# EAGLE design Mini_1284 (EAGLE 7.7.0)
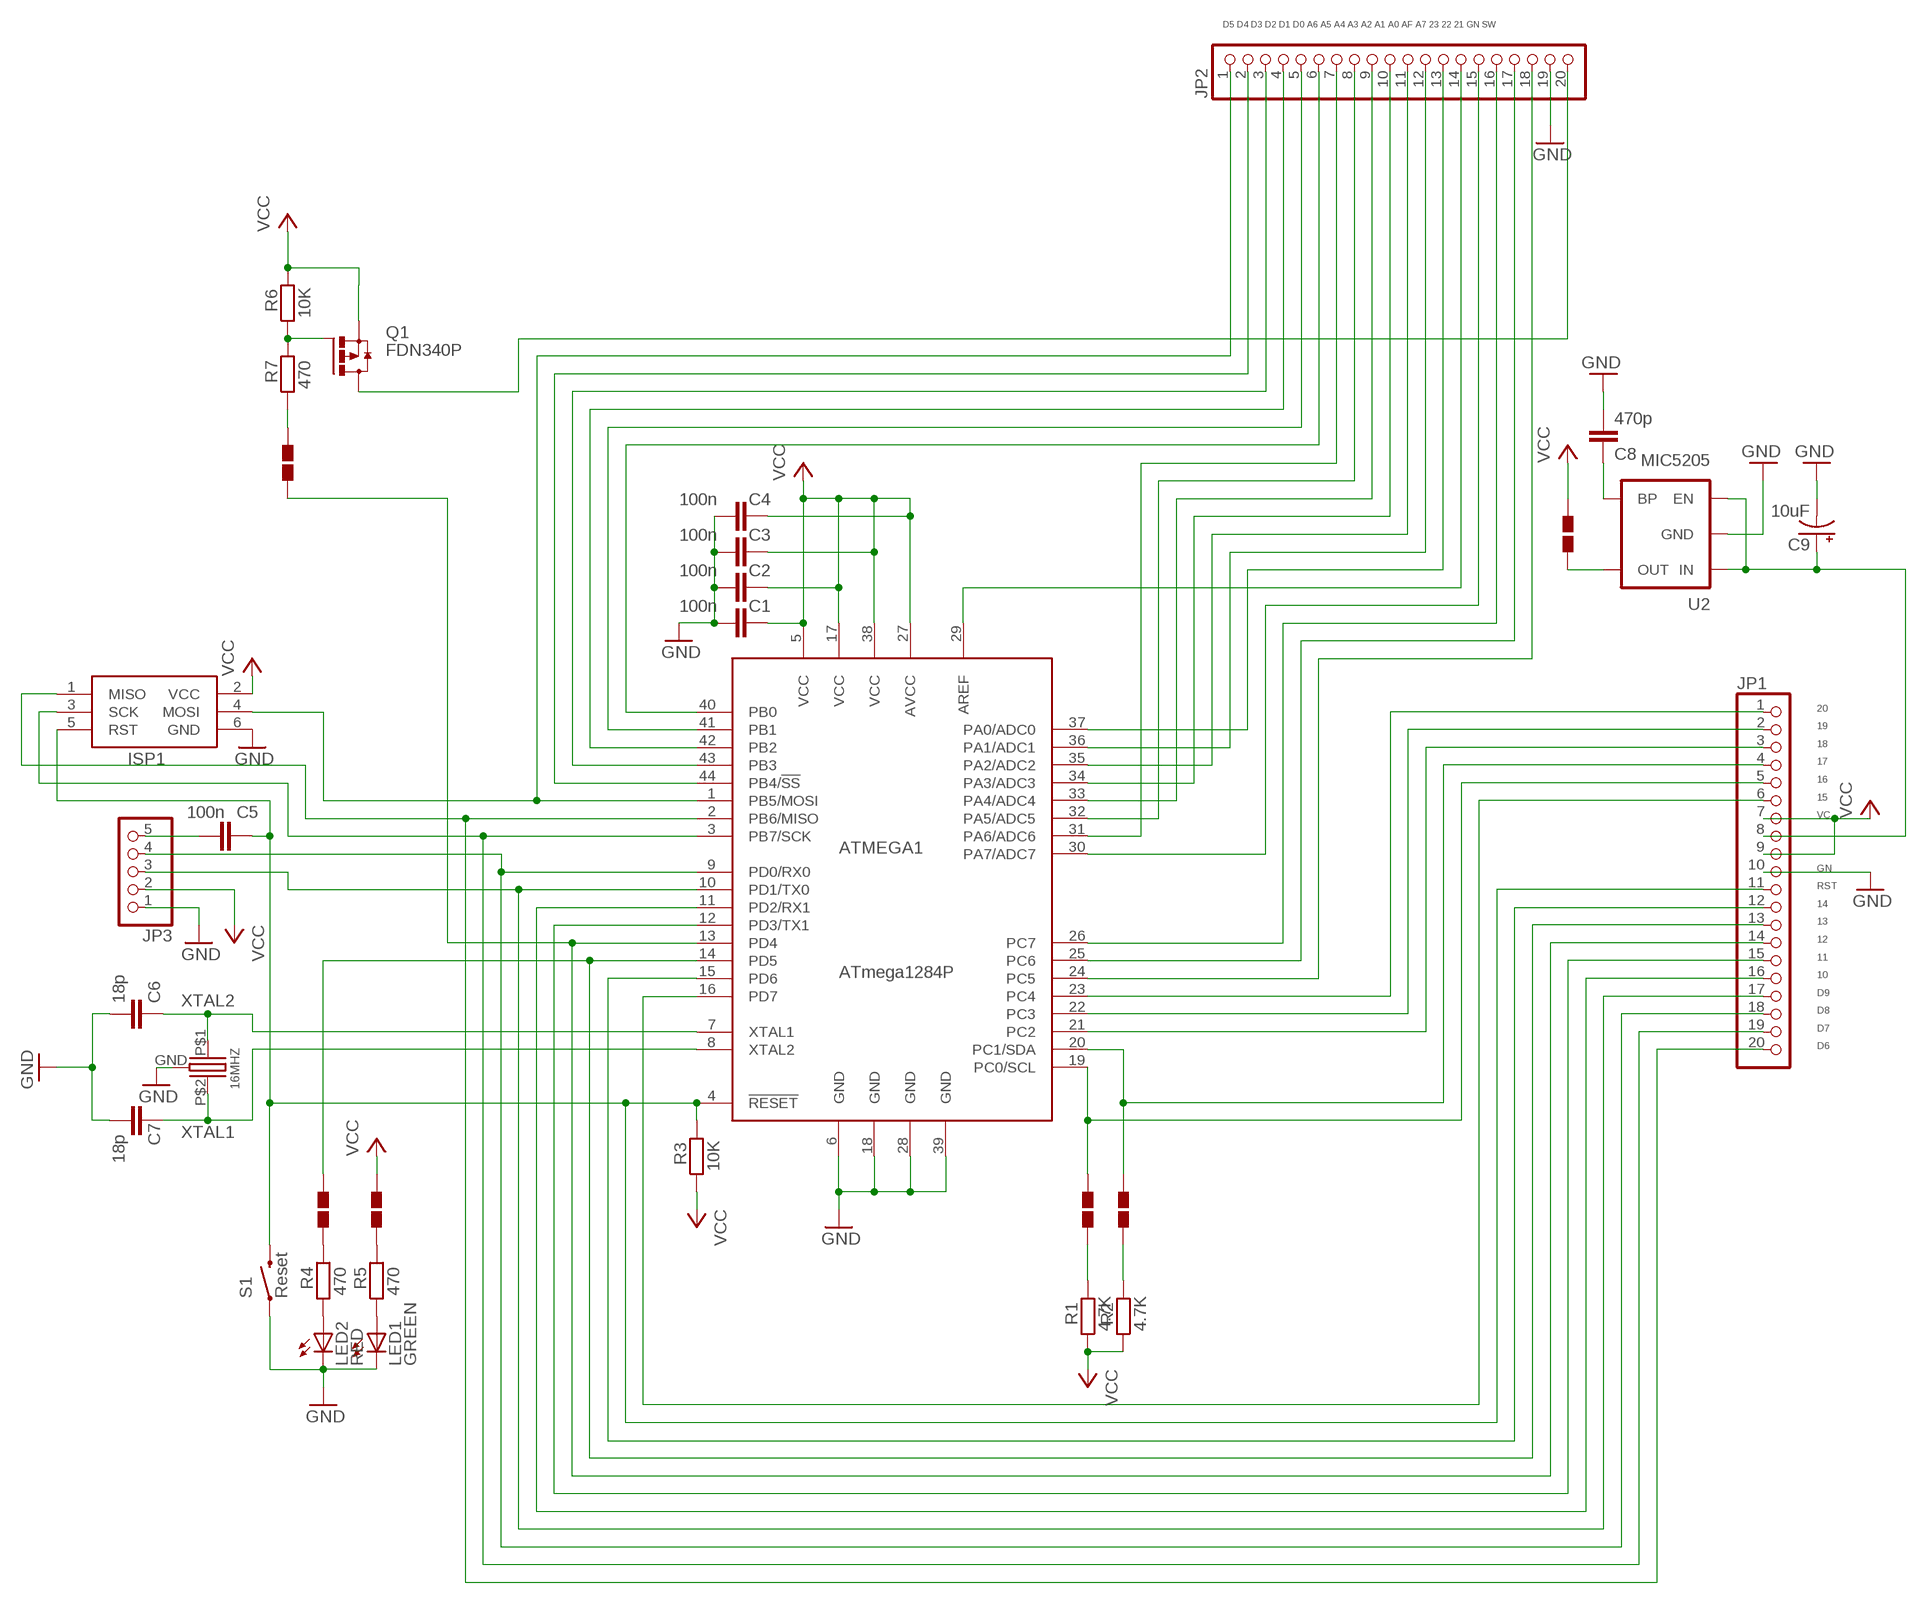
[diagram p0: schematic, sheet 1]

## Parts
16MHZ  CX2520  [CX2520]
ATMEGA1  ATmega1284P  ATMEGA164A/PA/324A/PA/644A/PA/1284/P  [44TQFP]
C1  100n  C0603-ROUND  [C0603-ROUND]
C2  100n  C0603-ROUND  [C0603-ROUND]
C3  100n  C0603-ROUND  [C0603-ROUND]
C4  100n  C0603-ROUND  [C0603-ROUND]
C5  100n  C0603-ROUND  [C0603-ROUND]
C6  18p  C0603-ROUND  [C0603-ROUND]
C7  18p  C0603-ROUND  [C0603-ROUND]
C8  470p  C0603-ROUND  [C0603-ROUND]
C9  10uF  CAP_POL1206  [EIA3216]
ISP1  AVRISP-6  [AVRISP]
JP1  PINHD-1X20  [1X20]
JP2  PINHD-1X20  [1X20]
JP3  PINHD-1X5  [1X05]
LED1  GREEN  LEDCHIP-LED0805  [CHIP-LED0805]
LED2  RED  LEDCHIP-LED0805  [CHIP-LED0805]
Q1  FDN340P  FDN360P  [SUPER-SOT3]
R1  4.7K  R0603-ROUND  [R0603-ROUND]
R2  4.7K  R0603-ROUND  [R0603-ROUND]
R3  10K  R0603-ROUND  [R0603-ROUND]
R4  470  R0603-ROUND  [R0603-ROUND]
R5  470  R0603-ROUND  [R0603-ROUND]
R6  10K  R0603-ROUND  [R0603-ROUND]
R7  470  R0603-ROUND  [R0603-ROUND]
S1  Reset  SWITCH-MOMENTARY-2SMD-ALT01  [TACTILE-SWITCH-SMD-ALT01]
U2  MIC5205  V_REG_LDOSMD  [SOT23-5]
U$4  SOL-PAD-OPEN  [SOL-PAD-OPEN]
U$5  SOL-PAD-OPEN  [SOL-PAD-OPEN]
U$8  SOL-PAD-OPEN  [SOL-PAD-OPEN]
U$9  SOL-PAD-OPEN  [SOL-PAD-OPEN]
U$12  SOL-PAD-OPEN  [SOL-PAD-OPEN]
U$13  SOL-PAD-OPEN  [SOL-PAD-OPEN]

## Nets
GND [gnd]: 16MHZ.GND ATMEGA1.6(GND) ATMEGA1.18(GND) ATMEGA1.28(GND) ATMEGA1.39(GND) C1.2 C2.2 C3.2 C4.2 C6.2 C7.2 C8.2 C9.C(-) ISP1.6(GND) JP1.10 JP2.19 JP3.1 LED1.C LED2.C S1.1 S1.2 U2.2(GND)
N$1: ATMEGA1.4(!RESET) C5.1 ISP1.5(RST) JP1.11 R3.2 S1.3 S1.4
N$2: C5.2 JP3.5
N$3: LED2.A R4.1
N$4: ATMEGA1.10(PD1/TX0) JP1.17 JP3.3
N$5: ATMEGA1.9(PD0/RX0) JP1.18 JP3.4
N$6: R1.2 U$4.P$1
N$7: ATMEGA1.20(PC1/SDA) JP1.4 U$12.P$1
N$8: LED1.A R5.1
N$9: R5.2 U$8.P$1
N$10: ATMEGA1.3(PB7/SCK) ISP1.3(SCK) JP1.19
N$11: ATMEGA1.2(PB6/MISO) ISP1.1(MISO) JP1.20
N$12: ATMEGA1.1(PB5/MOSI) ISP1.4(MOSI) JP2.1
N$13: R4.2 U$9.P$1
N$14: ATMEGA1.14(PD5) JP1.13 U$9.P$2
N$15: R2.2 U$12.P$2
N$16: ATMEGA1.23(PC4) JP1.1
N$17: ATMEGA1.19(PC0/SCL) JP1.5 U$4.P$2
N$18: ATMEGA1.16(PD7) JP1.6
N$19: ATMEGA1.15(PD6) JP1.12
N$20: ATMEGA1.40(PB0) JP2.6
N$21: ATMEGA1.21(PC2) JP1.3
N$22: ATMEGA1.22(PC3) JP1.2
N$23: ATMEGA1.13(PD4) JP1.14 U$5.P$1
N$24: ATMEGA1.12(PD3/TX1) JP1.15
N$25: ATMEGA1.11(PD2/RX1) JP1.16
N$26: ATMEGA1.41(PB1) JP2.5
N$27: ATMEGA1.42(PB2) JP2.4
N$28: ATMEGA1.43(PB3) JP2.3
N$29: ATMEGA1.44(PB4/!SS) JP2.2
N$30: ATMEGA1.36(PA1/ADC1) JP2.12
N$31: ATMEGA1.31(PA6/ADC6) JP2.7
N$32: ATMEGA1.32(PA5/ADC5) JP2.8
N$33: ATMEGA1.33(PA4/ADC4) JP2.9
N$34: ATMEGA1.34(PA3/ADC3) JP2.10
N$35: ATMEGA1.35(PA2/ADC2) JP2.11
N$36: ATMEGA1.37(PA0/ADC0) JP2.13
N$37: ATMEGA1.29(AREF) JP2.14
N$38: ATMEGA1.30(PA7/ADC7) JP2.15
N$39: ATMEGA1.26(PC7) JP2.16
N$40: ATMEGA1.25(PC6) JP2.17
N$41: ATMEGA1.24(PC5) JP2.18
N$42 [vcc]: U2.5(OUT) U$13.P$2
N$43: C8.1 U2.4(BP)
N$44: Q1.1(G) R6.1 R7.2
N$45 [switch]: JP2.20 Q1.3(D)
N$46: R7.1 U$5.P$2
RAW [raw]: C9.A(+) JP1.8 U2.1(IN) U2.3(EN)
VCC [vcc]: ATMEGA1.5(VCC) ATMEGA1.17(VCC) ATMEGA1.27(AVCC) ATMEGA1.38(VCC) C1.1 C2.1 C3.1 C4.1 ISP1.2(VCC) JP1.7 JP1.9 JP3.2 Q1.2(S) R1.1 R2.1 R3.1 R6.2 U$8.P$2 U$13.P$1
XTAL1: 16MHZ.P$2(XTAL2) ATMEGA1.8(XTAL2) C7.1
XTAL2: 16MHZ.P$1(XTAL1) ATMEGA1.7(XTAL1) C6.1

## Notes on the sheet
- D5 D4 D3 D2 D1 D0 A6 A5 A4 A3 A2 A1 A0 AF A7 23 22 21 GN SW
- 20
  19
  18
  17
  16
  15
  VC
  
  
  GN
  RST
  14
  13
  12
  11
  10
  D9
  D8
  D7
  D6

## Library data of the parts
16MHZ = CX2520:CX2520: CX2520 Series Crystal
ATMEGA1 = BaseApp:ATMEGA164A/PA/324A/PA/644A/PA/1284/P: Digikey No :- __ATMEGA1284-AU-ND__ 44TQFP __ATMEGA1284-MU-ND__ 44VQFN
C1-C8 = Max-RCL:C
C9 = SparkFun:CAP_POL: Capacitor Polarized These are standard SMD and PTH capacitors. Normally 10uF, 47uF, and 100uF in electrolytic and tantalum varieties. Always verify the external diameter of the through hole cap, it varies with capacity, voltage, and manufacturer. The EIA devices should be standard.
ISP1 = adafruit:AVRISP: AVR ISP HEADER Standard 6 pin header for AVR programming
JP1 JP2 = adafruit:PINHD-1X20: PIN HEADER
JP3 = pinhead:PINHD-1X5: PIN HEADER
LED1 LED2 = adafruit:LED: LED OSRAM: - CHIPLED LG R971, LG N971, LY N971, LG Q971, LY Q971, LO R971, LY R971 LH N974, LH R974 LS Q976, LO Q976, LY Q976 LO Q996 - Hyper CHIPLED LW Q18S LB Q993, LB Q99A, LB R99A - SideLED LS A670, LO A670, LY A670, LG A670, LP A670 LB A673, LV A673, LT A673, LW A673 LH A674 LY A675 LS A676, LA A676, LO A676, LY A676, LW A676 LS A679, LY A679, LG A679 - Hyper Micro SIDELED® LS Y876, LA Y876, LO Y876, LY Y876 LT Y87S - SmartLED LW L88C, LW L88S LB L89C, LB L89S, LG L890 LS L89K, LO L89K, LY L89K LS L896, LA L896, LO L896, LY L896 - TOPLED LS T670, LO T670, LY T670, LG T670, LP T670 LSG T670, LSP T670, LSY T670, LOP T670, LYG T670 LG T671, LOG T671, LSG T671 LB T673, LV T673, LT T673, LW T673 LH T674 LS T676, LA T676, LO T676, LY T676, LB T676, LH T676, LSB T676, LW T676 LB T67C, LV T67C, LT T67C, LS T67K, LO T67K, LY T67K, LW E67C LS E67B, LA E67B, LO E67B, LY E67B, LB E67C, LV E67C, LT E67C LW T67C LS T679, LY T679, LG T679 LS T770, LO T770, LY T770, LG T770, LP T770 LB T773, LV T773, LT T773, LW T773 LH T774 LS E675, LA E675, LY E675, LS T675 LS T776, LA T776, LO T776, LY T776, LB T776 LHGB T686 LT T68C, LB T68C - Hyper Mini TOPLED® LB M676 - Mini TOPLED Santana® LG M470 LS M47K, LO M47K, LY M47K Source: http://www.osram.convergy.de/
Q1 = transistor-power:FDN360P: Single P-Channel, PowerTrench (R) MOSFET Source: http://www.fairchildsemi.com/ds/FD/FDN360P.pdf
R1-R7 = Max-RCL:R
S1 = Testing:SWITCH-MOMENTARY-2: Various NO switches- pushbuttons, reed, etc
U2 = SparkFun:V_REG_LDO: Voltage Regulator LDO Standard 150mA LDO voltage regulator in SOT-23 layout. Micrel part MIC5205. BP (by-pass) pin is used to lower output noise with 470pF cap.
U$4 U$5 U$8 U$9 U$12 U$13 = PAD:SOL-PAD-OPEN

## Net classes
0 default: width 0.152 mm
1 vcc: width 0.254 mm
2 gnd: width 0.254 mm
3 raw: width 0.254 mm
4 switch: width 0.254 mm

## Board
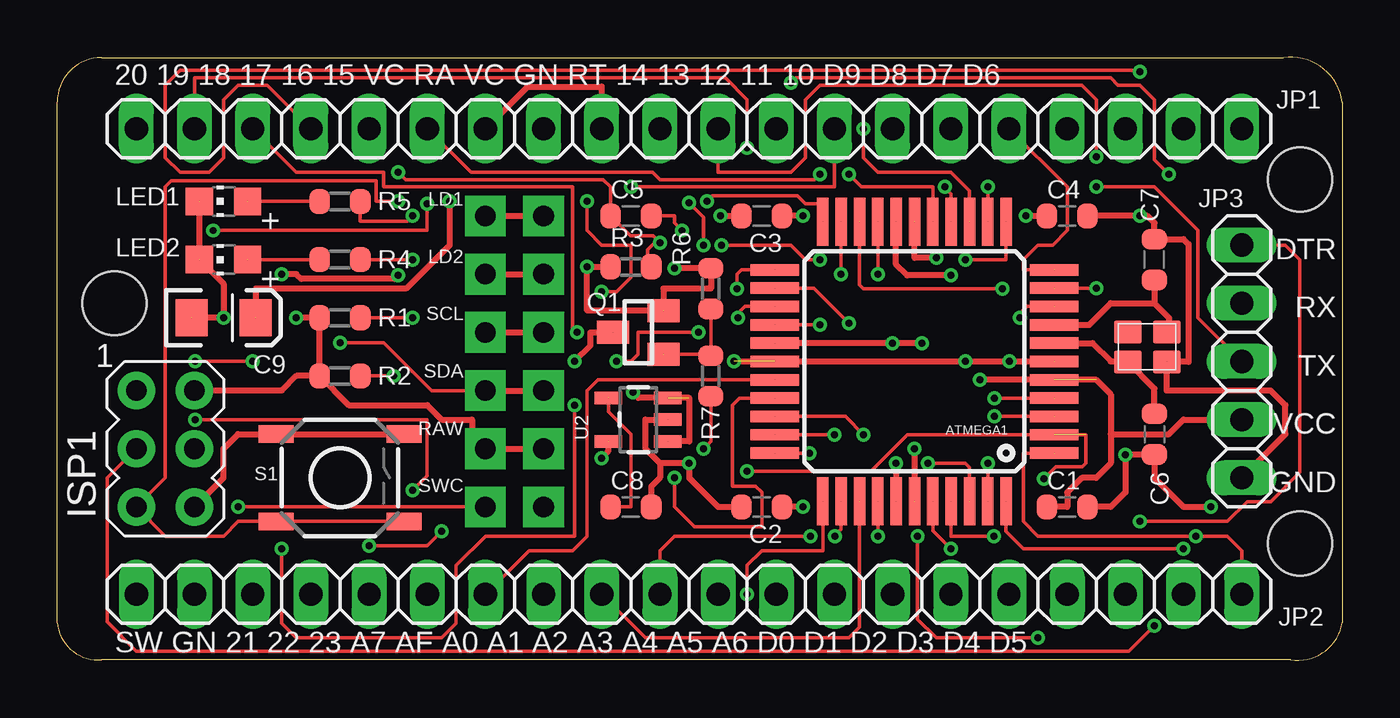
[diagram p1: board, top side]
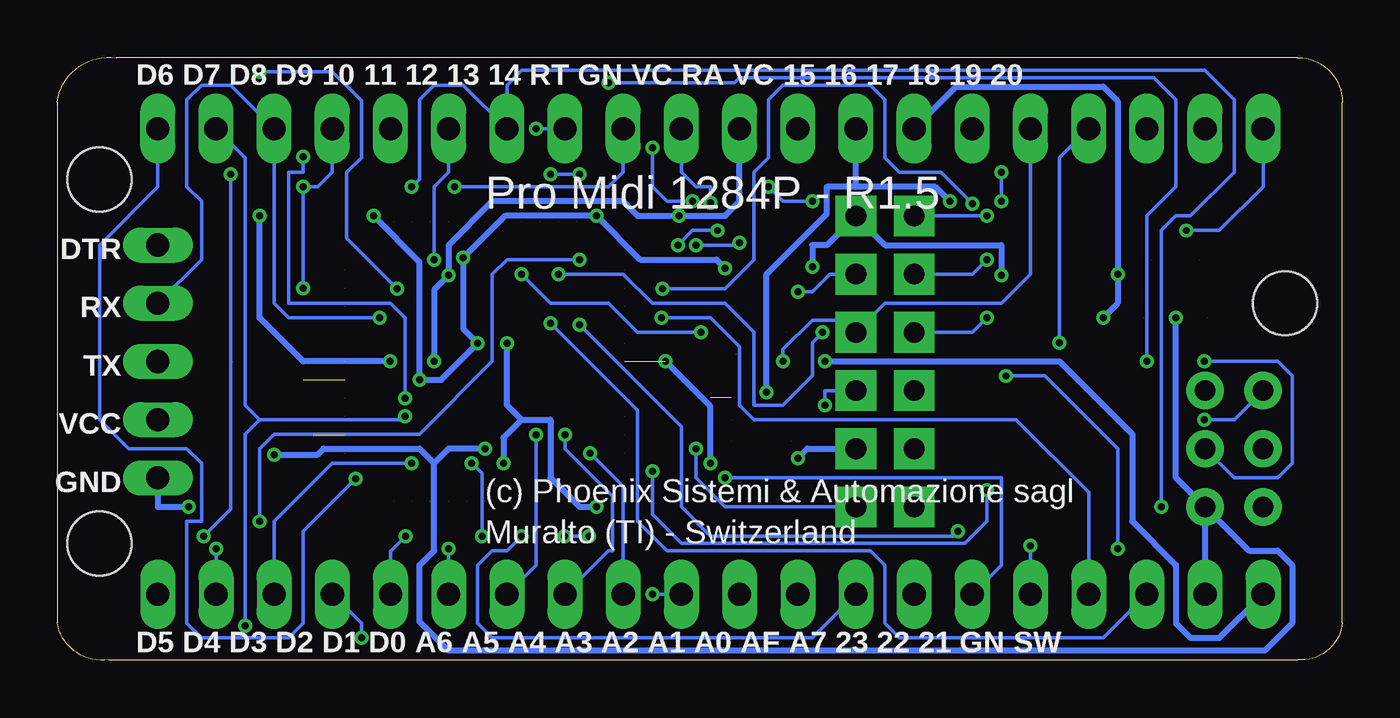
[diagram p2: board, bottom side, seen from below]

Size 56.1 x 26.32 mm. Coordinates in mm from the lower left corner, seen from the top.
Outline: 53.85,0.03 1.93,0.03 arc-90 0,1.64 0,24.36 arc-90 1.93,26.3 53.53,26.3 arc-90 56.1,24.36 56.1,1.64 arc-90 53.85,0.03
Copper layers (1*16): Top 0.035mm / dielectric 1.5mm / Bottom 0.035mm
Design rules "ITEADstudio_DRC": minimum track width 6mil, minimum drill 12mil, track to track 6mil, track to pad 6mil, pad to pad 6mil, via to via 6mil, smd to smd 0mil, copper to edge 10mil, drill to drill 10mil, minimum pad ring 10mil, minimum via ring 6mil, stop-mask expansion 2mil, vias tented up to drill 100mil, thermal gap 10mil
Holes 2.8 mm at 54.25,5.1 54.25,20.98 2.5,15.58
tRestrict: area 18.7,6.1 to 21.2,20

### Footprints (pad centres in the part's own frame; a part is rotated, then mirrored left to right if it is on the bottom)
CX2520 = smd 1.2 x 1: GND 0.85,-0.65; NC -0.85,0.65; P$1 -0.85,-0.65; P$2 0.85,0.65
44TQFP = smd 2.1 x 0.5: 1 -6.1,4; 2 -6.1,3.2; 3 -6.1,2.4; 4 -6.1,1.6; 5 -6.1,0.8; 6 -6.1,0; 7 -6.1,-0.8; 8 -6.1,-1.6; 9 -6.1,-2.4; 10 -6.1,-3.2; 11 -6.1,-4; 23 6.1,-4; 24 6.1,-3.2; 25 6.1,-2.4; 26 6.1,-1.6; 27 6.1,-0.8; 28 6.1,0; 29 6.1,0.8; 30 6.1,1.6; 31 6.1,2.4; 32 6.1,3.2; 33 6.1,4 | smd 0.5 x 2.1: 12 -4,-6.1; 13 -3.2,-6.1; 14 -2.4,-6.1; 15 -1.6,-6.1; 16 -0.8,-6.1; 17 0,-6.1; 18 0.8,-6.1; 19 1.6,-6.1; 20 2.4,-6.1; 21 3.2,-6.1; 22 4,-6.1; 34 4,6.1; 35 3.2,6.1; 36 2.4,6.1; 37 1.6,6.1; 38 0.8,6.1; 39 0,6.1; 40 -0.8,6.1; 41 -1.6,6.1; 42 -2.4,6.1; 43 -3.2,6.1; 44 -4,6.1
C0603-ROUND = smd 0.898 x 1.1: 1 -0.889,0; 2 0.889,0
EIA3216 = smd 1.4 x 1.6: A 1.4,0; C -1.4,0
AVRISP = drill 0.9 pad 1.626: 1 -1.27,2.54; 2 1.27,2.54; 3 -1.27,0; 4 1.27,0; 5 -1.27,-2.54; 6 1.27,-2.54
1X20 = drill 1.016 long: 1 -24.13,0; 2 -21.59,0; 3 -19.05,0; 4 -16.51,0; 5 -13.97,0; 6 -11.43,0; 7 -8.89,0; 8 -6.35,0; 9 -3.81,0; 10 -1.27,0; 11 1.27,0; 12 3.81,0; 13 6.35,0; 14 8.89,0; 15 11.43,0; 16 13.97,0; 17 16.51,0; 18 19.05,0; 19 21.59,0; 20 24.13,0
1X05 = drill 1.016 long: 1 -5.08,0; 2 -2.54,0; 3 0,0; 4 2.54,0; 5 5.08,0
CHIP-LED0805 = smd 1.2 x 1.2: A 0,-1.05; C 0,1.05
SUPER-SOT3 = smd 1 x 1.4: 1 -0.95,-1.1; 2 0.95,-1.1; 3 0,1.1
R0603-ROUND = smd 0.898 x 1.1: 1 -0.889,0; 2 0.889,0
TACTILE-SWITCH-SMD-ALT01 = smd 1.524 x 0.762: 1 -2.794,1.905; 2 2.794,1.905; 3 -2.794,-1.905; 4 2.794,-1.905
SOT23-5 = smd 0.55 x 1.2: 1 -0.95,-1.3; 2 0,-1.3; 3 0.95,-1.3; 4 0.95,1.3; 5 -0.95,1.3
SOL-PAD-OPEN = drill 0.9 pad 1.778 square: P$1 0,0; P$2 2.54,0

### Placement (x,y rotation side)
16MHZ  47.59,13.68 0 top
ATMEGA1  37.43,13.04 180 top
C1  44.09,6.69 0 top
C2  30.76,6.69 180 top
C3  30.76,19.39 180 top
C4  44.09,19.39 0 top
C5  25.04,19.39 0 top
C6  47.9,9.87 270 top
C7  47.9,17.49 90 top
C8  25.04,6.69 0 top
C9  7.26,14.95 0 top
ISP1  4.72,9.23 0 top
JP1  27.58,23.2 0 top
JP2  27.58,2.88 180 top
JP3  51.71,13.04 90 top
LED1  7.26,20.03 90 top
LED2  7.26,17.49 90 top
Q1  25.36,14.31 90 top
R1  12.34,14.95 0 top
R2  12.34,12.41 0 top
R3  25.04,17.17 0 top
R4  12.34,17.49 0 top
R5  12.34,20.03 0 top
R6  28.54,16.22 90 top
R7  28.54,12.41 90 top
S1  12.34,7.96 0 top
U2  25.36,10.5 90 top
U$4  18.69,14.31 0 top
U$5  18.69,6.69 0 top
U$8  18.69,19.39 0 top
U$9  18.69,16.85 0 top
U$12  18.69,11.77 0 top
U$13  18.69,9.23 0 top

### Tracks (layer width: path | path; a pad name or v marks a point on that pad's centre or on a via)
GND  (via drill 0.3 pad 0.61)  (9 unrouted)
  Top 0.254: 26.31,8.6 26.31,7.96 25.93,7.58 C8.2 | 26.31,8.6 25.68,9.23 25.68,10.5 U2.2 | C2.2 28.85,6.69 27.58,7.96 v27.58,8.6 26.31,8.6 | C1.2 46,6.69 46.63,7.33 v46.63,8.98 C6.2 47.9,7.96 49.17,6.69 v50.36,6.69 | LED1.C LED2.C 7.26,16.44 v7.26,14.95 C9.C | C4.2 v47.27,19.39 47.6,19.39 47.9,19.09 C7.2 49.17,18.37 49.38,18.16 49.38,13.03 16MHZ.GND 48.43,11.77 52.98,11.77 53.62,11.14 53.62,9.87 JP3.1 | ISP1.6 7.26,7.96 7.26,9.23 7.9,9.87 S1.1 S1.2 | v29.54,13.04 v39.65,13.04 v41.58,13.04 ATMEGA1.6 | v39.01,16.8 37.11,16.8 36.62,17.28 ATMEGA1.18 | v37.43,9.23 ATMEGA1.39 | v28.96,19.39 C3.2
  Bottom 0.254: ISP1.6 4.09,4.79 2.82,4.79 2.18,4.15 2.18,1.61 3.38,0.42 39.01,0.42 40.28,1.69 40.28,4.15 39.65,4.79 39.65,8.6 | v39.65,13.04 39.65,16.16 v39.01,16.8 39.01,18.12 37.11,20.03 31.39,20.03 30.76,19.39 v28.96,19.39 26.95,19.39 26.31,20.03 JP1.10 | v41.58,13.04 45.36,13.04 47.27,14.95 v47.27,19.39 | JP3.1 51.71,6.69 v50.36,6.69 | ISP1.6 7.26,7.96 v7.26,14.95 | v46.63,8.98 44.73,8.98 44.47,9.23 40.28,9.23 39.65,8.6 | ISP1.6 JP2.19 | v27.58,8.6 27.58,11.08 v29.54,13.04 | v37.43,9.23 39.01,9.23 39.65,8.6
N$1  (via drill 0.3 pad 0.61)  (1 unrouted)
  Top 0.152: R3.2 25.78,17.17 25.78,17.92 26.08,18.22 v26.31,18.22 26.02,18.52 25.03,18.52 C5.1 24.15,20.66 23.84,20.98 15.2,20.98 v14.88,21.3 | v14.88,20.03 13.93,20.03 13.93,20.92 4.99,20.92 4.72,20.66 4.72,7.96 ISP1.5 4.72,5.42 7.26,5.42 7.9,6.06 S1.3 S1.4 | v28.22,18.12 28.22,19.34 v27.58,19.97 | v40.92,11.44 ATMEGA1.4 | JP1.11 28.85,21.3 32.03,21.3 32.66,21.93 32.66,24.47 33.3,25.11 44.73,25.11 45.36,24.47 v45.36,21.98
  Bottom 0.152: v14.88,20.03 v14.88,21.3 | JP1.11 28.85,21.3 28.22,20.66 27.58,20.66 v27.58,19.97 | v26.31,18.22 26.41,18.12 v28.22,18.12 | v45.36,21.98 45.36,21.3 46,21.3 46,15.58 41.55,15.58 40.92,14.95 v40.92,11.44
N$2  (via drill 0.3 pad 0.61)
  Top 0.152: v27.29,18.76 26.95,19.09 26.95,19.39 C5.2 | v33.3,17.49 32.66,17.49 32.03,18.12 v29,18.12 | v47.27,6.06 51.08,6.06 51.95,6.93 52.98,6.93 54.25,8.2 54.25,17.49 53.62,18.12 JP3.5
  Bottom 0.152: v29,18.12 28.37,18.76 v27.29,18.76 | v47.27,6.06 47.27,9.23 46.63,9.87 40.28,9.87 37.11,13.04 37.11,16.85 36.47,17.49 v33.3,17.49
N$3  (1 unrouted)
  Top 0.152: R4.1 LED2.A
N$4  (via drill 0.3 pad 0.61)  (1 unrouted)
  Top 0.152: v45.36,20.66 47.9,20.66 49.81,18.76 49.81,14.95 JP3.3 | v45.36,16.24 ATMEGA1.10
  Bottom 0.152: JP1.17 44.09,21.3 44.73,20.66 v45.36,20.66 v45.36,16.24
N$5  (via drill 0.3 pad 0.61)  (1 unrouted)
  Top 0.152: v42.02,14.95 42.02,15.14 42.32,15.44 ATMEGA1.9
  Bottom 0.152: JP3.4 49.81,17.49 49.81,20.03 50.44,20.66 50.44,24.47 49.81,25.11 48.54,25.11 JP1.18 46.63,15.58 46,14.95 v42.02,14.95
N$6  (via drill 0.3 pad 0.61)
  Top 0.152: v15.52,14.95 R1.2
  Bottom 0.152: v15.52,14.95 16.15,14.31 U$4.P$1
N$7  (via drill 0.3 pad 0.61)  (1 unrouted)
  Top 0.152: v12.34,13.86 14.25,13.86 16.34,11.77 U$12.P$1 | v41.26,16.22 35.2,16.22 35.02,16.39 ATMEGA1.20 | JP1.4 9.17,25.11 7.9,25.11 7.26,24.47 7.26,21.93 6.63,21.3 5.36,21.3 4.72,21.93 4.72,25.11 5.36,25.74 47.22,25.74 v47.27,25.69
  Bottom 0.152: JP1.4 12.34,21.93 v12.34,13.86 | v47.27,25.69 44.09,25.69 42.82,24.42 42.82,21.93 43.46,21.3 43.46,18.42 v41.26,16.22
N$8  (1 unrouted)
  Top 0.152: LED1.A R5.1
N$9  (via drill 0.3 pad 0.61)
  Top 0.152: v15.52,19.39 15.28,19.15 13.23,19.15 R5.2
  Bottom 0.152: v15.52,19.39 U$8.P$1
N$10  (via drill 0.3 pad 0.61)  (1 unrouted)
  Top 0.152: v40.92,10.64 ATMEGA1.3 | v47.9,1.51 46.8,0.4 3.45,0.4 2.18,1.67 2.18,7.96 ISP1.3
  Bottom 0.152: 47.27,10.5 47.9,11.14 47.9,21.93 JP1.19 | 47.27,10.5 41.06,10.5 v40.92,10.64 | 47.27,10.5 47.9,9.87 v47.9,1.51
N$11  (via drill 0.3 pad 0.61)  (1 unrouted)
  Top 0.152: v30.12,8.25 35.52,8.25 37.11,9.84 44.91,9.84 44.91,8.6 44.75,8.44 43.6,8.44 v43.08,7.91 | v6.02,10.5 16.15,10.5 16.15,8.06 v15.52,7.43 | v43.08,7.91
  Bottom 0.152: v15.52,7.43 15.52,6.06 16.48,5.1 28.85,5.1 30.12,6.37 v30.12,8.25 | v6.02,10.5 4.72,10.5 ISP1.1 | v43.08,7.91 45.36,5.63 45.36,1.61 46,0.98 49.81,0.98 50.44,1.61 50.44,6.06 49.81,6.06 49.81,8.6 50.44,9.23 52.98,9.23 54.25,10.5 54.25,18.12 51.71,20.66 JP1.20
N$12  (via drill 0.3 pad 0.61)  (1 unrouted)
  Top 0.152: JP2.1 51.71,4.79 51.08,5.42 v49.71,5.42 42.82,5.42 42.19,6.06 42.19,9.04 ATMEGA1.1 | v32.03,25.21 32.24,25.42 46,25.42 46.32,25.11 47.27,25.11 47.9,24.47 47.9,21.84 v48.54,21.21 | v6.02,13.04 v8.53,13.04
  Bottom 0.152: v48.54,21.21 48.54,6.59 v49.71,5.42 | v8.53,13.04 8.53,19.39 7.26,20.66 7.26,24.47 8.22,25.42 26.31,25.42 26.53,25.21 v32.03,25.21 | v6.02,13.04 2.82,13.04 2.18,12.41 2.18,8.6 2.82,7.96 4.72,7.96 ISP1.4
N$13  (via drill 0.3 pad 0.61)
  Top 0.152: v15.52,17.49 R4.2
  Bottom 0.152: v15.52,17.49 16.15,16.85 U$9.P$1
N$14  (via drill 0.3 pad 0.61)  (1 unrouted)
  Top 0.152: JP1.13 33.93,20.66 v25.04,20.66 | v23.77,16.07 24.41,16.07 25.04,16.71 25.04,18.12 23.77,18.12 23.14,18.76 v23.14,20.03 | v35.2,23.2 35.2,21.93 35.84,21.3 39.01,21.3 39.83,20.48 ATMEGA1.14
  Bottom 0.152: v23.14,20.03 24.41,20.03 v25.04,20.66 | v23.77,16.07 23.14,16.07 22.36,16.85 U$9.P$2 | JP1.13 v35.2,23.2
N$15  (via drill 0.3 pad 0.61)
  Top 0.152: v14.68,12.41 R2.2 | v22.59,11.14 22.59,5.42 18.69,5.42 17.42,4.15 17.42,1.61 16.79,0.98 10.44,0.98 9.8,1.61 v9.8,4.86
  Bottom 0.152: v9.8,4.86 9.8,9.23 12.98,12.41 v14.68,12.41 | v22.59,11.14 22.59,11.77 U$12.P$2
N$16  (via drill 0.3 pad 0.61)  (1 unrouted)
  Top 0.152: v29.68,16.22 29.68,16.85 29.87,17.04 ATMEGA1.23 | v6.8,18.76 16.15,18.76 v16.15,19.93
  Bottom 0.152: v16.15,19.93 17.52,21.3 19.33,21.3 19.96,21.93 19.96,24.47 20.6,25.11 24.41,25.11 25.04,24.47 25.04,21.93 25.68,21.3 25.68,17.49 26.95,16.22 v29.68,16.22 | v6.8,18.76 5.36,18.76 3.45,20.66 JP1.1
N$17  (via drill 0.3 pad 0.61)  (1 unrouted)
  Top 0.152: v35.83,16.85 ATMEGA1.19 | v24.41,13.04 25.04,13.04 25.36,13.36 25.36,14.31 v28,14.31
  Bottom 0.152: JP1.5 13.61,16.85 14.88,15.58 19.96,15.58 U$4.P$2 21.77,14.84 23.14,14.84 24.41,13.57 v24.41,13.04 | v28,14.31 30.76,14.31 32.03,15.58 34.56,15.58 v35.83,16.85
N$18  (via drill 0.3 pad 0.61)  (1 unrouted)
  Top 0.152: v34.57,21.21 35.11,20.66 38.23,20.66 ATMEGA1.16 | v33.3,21.21 33.06,20.98 26.31,20.98 26,21.3 18.06,21.3 JP1.6
  Bottom 0.152: v33.3,21.21 v34.56,21.21 v34.57,21.21
N$19  (via drill 0.3 pad 0.61)  (1 unrouted)
  Top 0.152: v38.76,20.66 38.76,20.62 39.02,20.36 ATMEGA1.15
  Bottom 0.152: v38.76,20.66 32.03,20.66 31.39,21.3 JP1.12
N$20  (via drill 0.3 pad 0.61)  (1 unrouted)
  Top 0.152: v39.01,4.87 38.23,5.66 ATMEGA1.40
  Bottom 0.152: v39.01,4.87 JP2.6
N$21  (via drill 0.3 pad 0.61)  (1 unrouted)
  Top 0.152: v34.23,16.85 ATMEGA1.21 | v22.69,14.31 22.5,14.5 22.5,20.66 14.25,20.66 14.25,21.3 10.44,21.3 JP1.3
  Bottom 0.152: v22.69,14.31 23.14,13.87 23.14,12.41 24.41,11.14 25.68,11.14 25.68,14.31 26.95,15.58 30.12,15.58 31.39,16.85 v34.23,16.85
N$22  (via drill 0.3 pad 0.61)  (1 unrouted)
  Top 0.152: v28.36,20.03 28.6,20.26 | 28.6,20.26 | 28.6,20.26 32.32,20.26 32.66,19.92 33.43,19.92 ATMEGA1.22 | v30.12,22.38 30.12,24.47 29.17,25.42 5.99,25.42 JP1.2
  Bottom 0.152: v30.12,22.38 30.12,20.66 29.49,20.03 v28.36,20.03
N$23  (via drill 0.3 pad 0.61)  (1 unrouted)
  Top 0.152: v7.9,6.69 U$5.P$1 | v40.62,20.66 ATMEGA1.13
  Bottom 0.152: v7.9,6.69 7.9,18.76 7.26,19.39 6.63,19.39 4.72,21.3 4.72,24.47 5.99,25.74 35.84,25.74 36.47,25.11 JP1.14 38.38,25.11 39.65,25.11 40.28,24.47 40.28,21 v40.62,20.66
N$24  (via drill 0.3 pad 0.61)  (1 unrouted)
  Top 0.152: v39.65,17.49 41.42,17.49 ATMEGA1.12
  Bottom 0.152: v39.65,17.49 39.65,20.66 39.01,21.3 JP1.15
N$25  (1 unrouted)
  Top 0.152: JP1.16 44.09,20.66 44.09,18.76 43.46,18.12 42.82,18.12 42.19,17.49 42.19,17.04 ATMEGA1.11
N$26  (via drill 0.3 pad 0.61)  (1 unrouted)
  Top 0.152: v40.89,5.42 39.02,5.42 ATMEGA1.41
  Bottom 0.152: v40.89,5.42 41.55,4.76 JP2.5
N$27  (via drill 0.3 pad 0.61)  (1 unrouted)
  Top 0.152: v38.01,8.6 39.65,8.6 39.83,8.42 ATMEGA1.42 | v42.82,0.98 38.38,0.98 37.56,1.79 v37.56,5.42
  Bottom 0.152: v37.56,5.42 37.56,8.15 v38.01,8.6 | v42.82,0.98 42.82,1.61 JP2.4
N$28  (via drill 0.3 pad 0.61)  (1 unrouted)
  Top 0.152: v40.62,8.6 ATMEGA1.43
  Bottom 0.152: v40.62,8.6 44.09,8.6 46.63,6.06 JP2.3
N$29  (via drill 0.3 pad 0.61)  (1 unrouted)
  Top 0.152: v49.17,4.87 42.19,4.87 41.42,5.64 ATMEGA1.44
  Bottom 0.152: v49.17,4.87 JP2.2
N$30  (1 unrouted)
  Top 0.152: JP2.12 25.68,0.98 34.57,0.98 35.02,1.43 ATMEGA1.36
N$31  (via drill 0.3 pad 0.61)  (1 unrouted)
  Top 0.152: v35.2,9.84 34.4,10.64 ATMEGA1.31
  Bottom 0.152: v35.2,9.84 35.2,4.15 JP2.7
N$32  (via drill 0.3 pad 0.61)  (1 unrouted)
  Top 0.152: v33.93,9.84 ATMEGA1.32
  Bottom 0.152: v33.93,9.84 33.93,9.23 31.86,7.16 31.86,4.79 32.03,4.79 JP2.8
N$33  (via drill 0.3 pad 0.61)  (1 unrouted)
  Top 0.152: v32.83,9.04 ATMEGA1.33
  Bottom 0.152: v32.83,9.04 31.39,7.6 JP2.9
N$34  (via drill 0.3 pad 0.61)  (1 unrouted)
  Top 0.152: v30.12,2.88 30.12,4.15 30.76,4.79 33.43,4.79 ATMEGA1.34
  Bottom 0.152: v30.12,2.88 JP2.10
N$35  (via drill 0.3 pad 0.61)  (1 unrouted)
  Top 0.152: v33.96,5.42 33.96,5.46 34.23,5.73 ATMEGA1.35 | v32.89,5.42 26.95,5.42 26.31,4.79 JP2.11
  Bottom 0.152: v32.89,5.42 v33.96,5.42
N$36  (via drill 0.3 pad 0.61)  (1 unrouted)
  Top 0.152: v35.83,5.42 ATMEGA1.37
  Bottom 0.152: v35.83,5.42 36.46,4.79 37.11,4.79 37.74,4.15 37.74,1.61 37.11,0.98 23.14,0.98 JP2.13
N$37  (1 unrouted)
  Top 0.152: JP2.14 20.6,4.79 22.5,4.79 23.14,5.42 23.14,11.77 23.61,12.24 ATMEGA1.29
N$38  (via drill 0.3 pad 0.61)  (1 unrouted)
  Top 0.152: v26.95,7.96 26.95,6.69 27.82,5.82 30.76,5.82 30.76,7.33 30.49,7.59 29.49,7.59 29.49,11.14 29.79,11.44 ATMEGA1.30
  Bottom 0.152: v26.95,7.96 14.88,7.96 14.88,4.15 JP2.15
N$39  (via drill 0.3 pad 0.61)  (1 unrouted)
  Top 0.152: v33.3,14.64 ATMEGA1.26 | v13.61,5 16.15,5 v16.79,5.64
  Bottom 0.152: v16.79,5.64 17,5.42 27.58,5.42 28.85,6.69 28.85,10.2 v33.3,14.64 | v13.61,5 JP2.16
N$40  (via drill 0.3 pad 0.61)  (1 unrouted)
  Top 0.152: v29.71,14.95 29.71,15.14 30.02,15.44 ATMEGA1.25
  Bottom 0.152: v29.71,14.95 27.58,14.95 26.31,13.68 26.31,11.14 25.68,10.5 14.25,10.5 11.07,7.33 JP2.17
N$41  (via drill 0.3 pad 0.61)  (1 unrouted)
  Top 0.152: v34.57,14.71 33.04,16.24 ATMEGA1.24
  Bottom 0.152: v34.57,14.71 30.76,10.9 30.76,6.06 29.49,4.79 20.6,4.79 19.96,4.15 19.96,1.61 19.33,0.98 10.44,0.98 JP2.18
N$42  (via drill 0.3 pad 0.61)  (1 unrouted)
  Top 0.254: v23.77,8.82 23.77,8.84 24.06,9.12 U2.5
  Bottom 0.254: v23.77,8.82 23.36,9.23 U$13.P$2
N$43  (1 unrouted)
  Top 0.152: C8.1 25.04,6.69 25.04,9.87 24.06,10.85 U2.4
N$44  (1 unrouted)
  Top 0.152: 28.54,13.36 Q1.1 | 28.54,13.36 R6.1 | 28.54,13.36 R7.2
N$45  (via drill 0.3 pad 0.61)  (1 unrouted)
  Top 0.254: v22.59,13.04 23.28,13.73 | 23.28,13.73 | 23.28,13.73 23.28,14.31 Q1.3
  Bottom 0.254: v22.59,13.04 12.34,13.04 9.17,9.87 9.17,6.06 7.26,4.15 7.26,1.61 6.63,0.98 5.36,0.98 JP2.20
N$46  (via drill 0.3 pad 0.61)
  Top 0.152: v28.22,9.23 28.54,9.55 R7.1
  Bottom 0.152: v28.22,9.23 28.22,7.96 26.95,6.69 U$5.P$2
N$47
  Top 0.254: 19.33,19.39 20.6,19.39 | 19.33,16.85 20.6,16.85 | 19.33,14.31 20.6,14.31 | 19.33,11.77 20.6,11.77 | 19.33,9.23 20.6,9.23
RAW  (via drill 0.3 pad 0.61)  (3 unrouted)
  Top 0.254: v17.13,20.03 17.13,18.12 15.23,16.22 8.66,16.22 C9.A | U2.1 27.58,9.55 27.58,11.45 25.38,11.45 v25.13,11.7
  Bottom 0.254: v17.13,20.03 17.77,20.66 21.23,20.66 | 21.23,20.66 22.5,20.66 22.5,19.48 25.13,16.85 v25.13,11.7 | 21.23,20.66 JP1.8
VCC  (via drill 0.3 pad 0.61)  (5 unrouted)
  Top 0.254: R2.1 12.72,11.14 16.15,11.14 16.79,10.5 18.11,10.5 18.11,9.23 U$13.P$1 | R2.1 10.44,12.41 9.8,11.77 ISP1.2 | 46,9.87 48.54,9.87 49.17,10.5 JP3.2 | v37.74,13.84 v36.47,13.84 ATMEGA1.27 | 46,9.87 46,8.6 45.36,7.96 44.73,7.96 44.09,7.33 44.09,6.69 C1.1 | v14.88,16.8 14.72,16.64 10.65,16.64 10.44,16.85 v9.8,16.85 | R2.1 R1.1 v10.44,14.95 | v26.95,17.1 R6.2 28.54,16.22 26.46,16.22 Q1.2 23.14,15.26 v23.14,17.17 R3.1 | v32.55,6.69 C2.1 | v42.3,19.39 C4.1 | JP1.7 20.53,25.04 23.77,25.04 JP1.9 | 46,9.87 46,11.61 45.36,12.24 v40.28,12.24 | v38.38,17.56 37.43,17.56 ATMEGA1.17 | v36.62,8.6 ATMEGA1.38 | v32.55,19.39 C3.1
  Bottom 0.254: 35.84,10.5 36.47,11.14 v36.47,13.84 | v14.88,16.8 14.88,18.12 19.96,18.12 U$8.P$2 22.5,18.12 23.14,18.12 v23.14,17.17 | v10.44,14.95 9.8,15.58 v9.8,16.85 9.8,24.4 10.44,25.04 16.86,25.04 JP1.7 | v26.95,17.1 27.33,17.49 30.65,17.49 v32.55,19.39 36.55,19.39 v38.38,17.56 38.38,14.48 v37.74,13.84 | 35.84,10.5 34.57,10.5 34.57,7.96 33.3,6.69 v32.55,6.69 | v42.3,19.39 40.28,17.38 v40.28,12.24 39.34,12.24 v37.74,13.84 | v37.74,13.84 | 35.84,10.5 36.62,9.71 v36.62,8.6
XTAL1
  Top 0.254: ATMEGA1.8 45.06,14.64 46,15.58 47.9,15.58 | 47.9,15.58 48.54,14.95 48.54,14.43 16MHZ.P$2 | C7.1 47.9,15.58
XTAL2
  Top 0.254: ATMEGA1.7 45.2,13.84 46,13.04 46.72,13.04 16MHZ.P$1 47.9,11.86 C6.1

### Text on the board
tNames: 20 19 18 17 16 15 VC RA VC GN RT 14 13 12 11 10 D9 D8 D7 D6 | LD1 / / LD2 / / SCL / / SDA / / RAW / / SWC | DTR / RX / TX / VCC / GND | SW GN 21 22 23 A7 AF A0 A1 A2 A3 A4 A5 A6 D0 D1 D2 D3 D4 D5
bNames: D6 D7 D8 D9 10 11 12 13 14 RT GN VC RA VC 15 16 17 18 19 20 | Pro Midi 1284P - R1.5 | DTR / RX / TX / VCC / GND | (c) Phoenix Sistemi & Automazione sagl / Muralto (TI) - Switzerland | D5 D4 D3 D2 D1 D0 A6 A5 A4 A3 A2 A1 A0 AF A7 23 22 21 GN SW